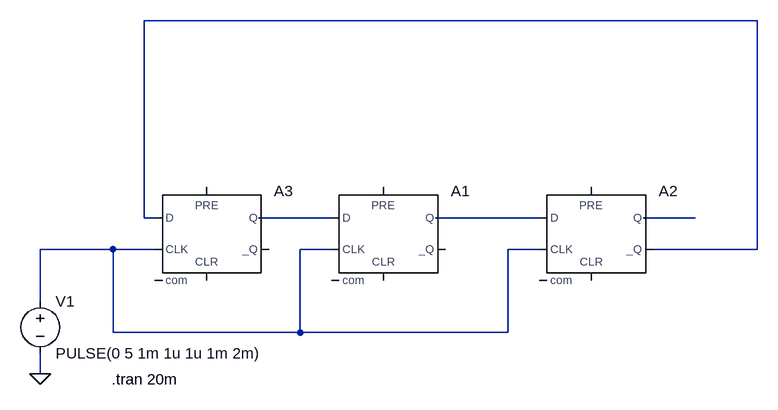
[diagram p0: schematic dflipflop_counter.asc]
dflipflop_counter.asc, the LTspice schematic file:
Version 4
SHEET 1 880 680
WIRE 720 -176 -224 -176
WIRE -224 128 -224 -176
WIRE -208 128 -224 128
WIRE 64 128 -48 128
WIRE 384 128 224 128
WIRE 624 128 544 128
WIRE -272 176 -384 176
WIRE -208 176 -272 176
WIRE 64 176 16 176
WIRE 384 176 336 176
WIRE 720 176 720 -176
WIRE 720 176 560 176
WIRE -384 256 -384 176
WIRE -272 304 -272 176
WIRE 16 304 16 176
WIRE 16 304 -272 304
WIRE 336 304 336 176
WIRE 336 304 16 304
WIRE -384 368 -384 336
FLAG -384 368 0
SYMBOL Digital\\dflop 144 80 R0
SYMATTR InstName A1
SYMATTR SpiceLine Vhigh 5 Trise 10n
SYMBOL Digital\\dflop 464 80 R0
SYMATTR InstName A2
SYMATTR SpiceLine Vhigh 5 Trise 10n
SYMBOL Digital\\dflop -128 80 R0
SYMATTR InstName A3
SYMATTR SpiceLine Vhigh 5 Trise 10n
SYMBOL voltage -384 240 R0
WINDOW 123 0 0 Left 0
WINDOW 39 0 0 Left 0
SYMATTR InstName V1
SYMATTR Value PULSE(0 5 1m 1u 1u 1m 2m)
TEXT -274 376 Left 2 !.tran 20m

The netlist it stands for:
* dflipflop_counter.asc
A1 N002 0 N005 0 0 0 N003 0 DFLOP Vhigh 5 Trise 10n
A2 N003 0 N005 0 0 N001 N004 0 DFLOP Vhigh 5 Trise 10n
A3 N001 0 N005 0 0 0 N002 0 DFLOP Vhigh 5 Trise 10n
V1 N005 0 PULSE(0 5 1m 1u 1u 1m 2m)
.tran 20m
.backanno
.end